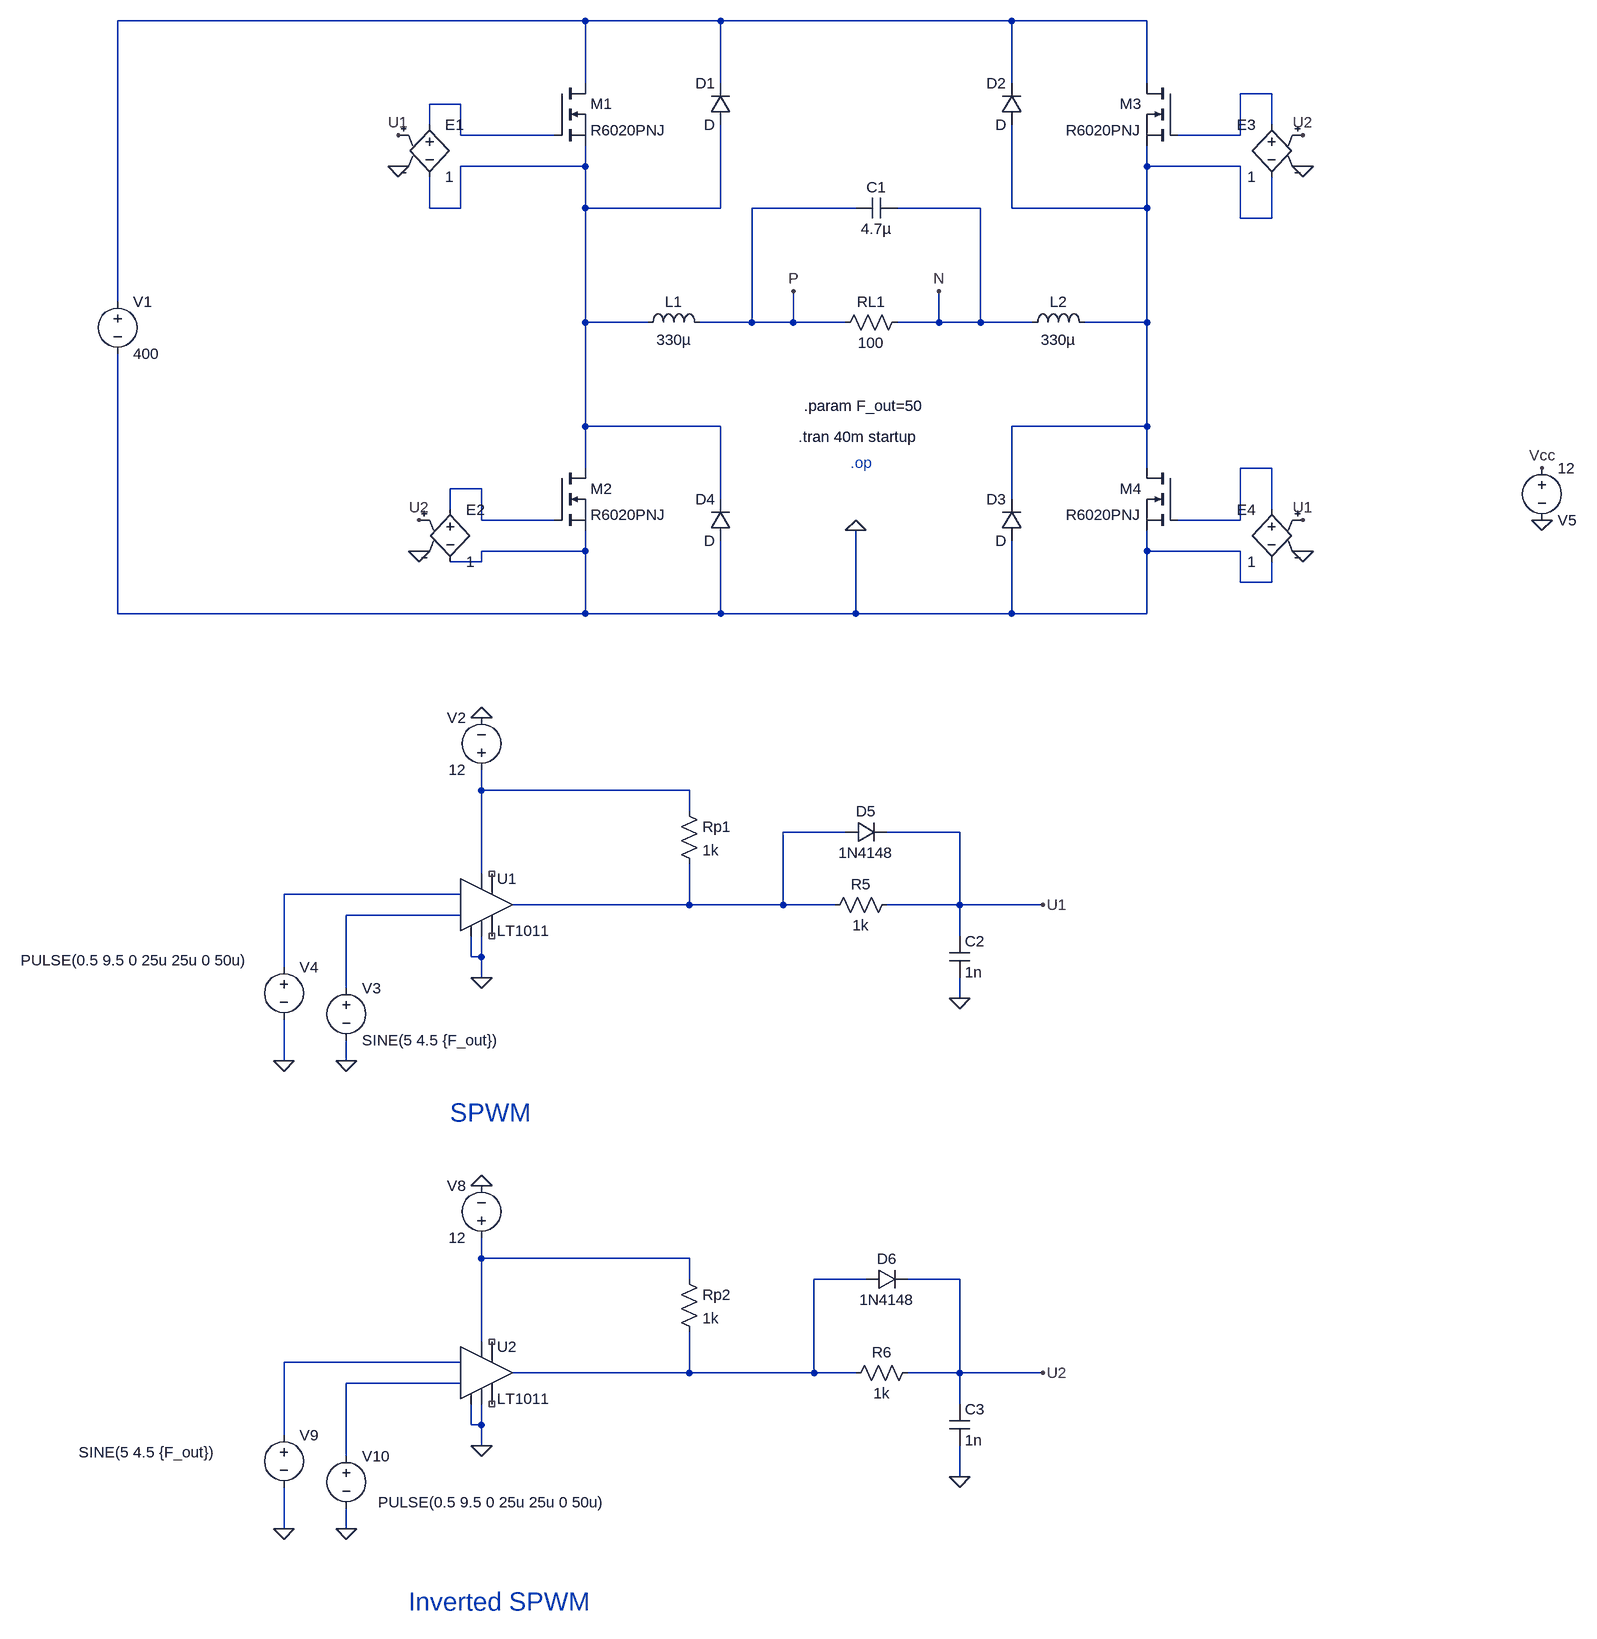
[diagram p0: schematic VCVS_Swtiches.asc]
VCVS_Swtiches.asc, the LTspice schematic file:
Version 4.1
SHEET 1 1320 1532
WIRE -208 -928 -928 -928
WIRE 0 -928 -208 -928
WIRE 448 -928 0 -928
WIRE 656 -928 448 -928
WIRE -208 -832 -208 -928
WIRE 0 -832 0 -928
WIRE 448 -832 448 -928
WIRE 656 -832 656 -928
WIRE 848 -816 800 -816
WIRE -400 -800 -448 -800
WIRE -448 -768 -448 -800
WIRE 848 -768 848 -816
WIRE -400 -752 -400 -800
WIRE -256 -752 -400 -752
WIRE 800 -752 800 -816
WIRE 800 -752 704 -752
WIRE -208 -704 -208 -736
WIRE -208 -704 -400 -704
WIRE 656 -704 656 -736
WIRE 800 -704 656 -704
WIRE -448 -640 -448 -688
WIRE -400 -640 -400 -704
WIRE -400 -640 -448 -640
WIRE -208 -640 -208 -704
WIRE 0 -640 0 -768
WIRE 0 -640 -208 -640
WIRE 208 -640 48 -640
WIRE 400 -640 272 -640
WIRE 448 -640 448 -768
WIRE 656 -640 656 -704
WIRE 656 -640 448 -640
WIRE 800 -624 800 -704
WIRE 848 -624 848 -688
WIRE 848 -624 800 -624
WIRE -928 -496 -928 -928
WIRE -208 -464 -208 -640
WIRE -112 -464 -208 -464
WIRE 48 -464 48 -640
WIRE 48 -464 -32 -464
WIRE 112 -464 112 -512
WIRE 112 -464 48 -464
WIRE 192 -464 112 -464
WIRE 336 -464 336 -512
WIRE 336 -464 272 -464
WIRE 400 -464 400 -640
WIRE 400 -464 336 -464
WIRE 480 -464 400 -464
WIRE 656 -464 656 -640
WIRE 656 -464 560 -464
WIRE -208 -304 -208 -464
WIRE 0 -304 -208 -304
WIRE 656 -304 656 -464
WIRE 656 -304 448 -304
WIRE -208 -240 -208 -304
WIRE 656 -240 656 -304
WIRE 848 -240 800 -240
WIRE -368 -208 -416 -208
WIRE 0 -192 0 -304
WIRE 448 -192 448 -304
WIRE -416 -176 -416 -208
WIRE 848 -176 848 -240
WIRE -368 -160 -368 -208
WIRE -256 -160 -368 -160
WIRE 800 -160 800 -240
WIRE 800 -160 704 -160
WIRE -208 -112 -208 -144
WIRE -208 -112 -368 -112
WIRE 656 -112 656 -144
WIRE 800 -112 656 -112
WIRE -368 -96 -368 -112
WIRE -368 -96 -416 -96
WIRE 800 -64 800 -112
WIRE 848 -64 848 -96
WIRE 848 -64 800 -64
WIRE -928 -16 -928 -416
WIRE -208 -16 -208 -112
WIRE -208 -16 -928 -16
WIRE 0 -16 0 -128
WIRE 0 -16 -208 -16
WIRE 208 -16 208 -144
WIRE 208 -16 0 -16
WIRE 448 -16 448 -128
WIRE 448 -16 208 -16
WIRE 656 -16 656 -112
WIRE 656 -16 448 -16
WIRE -368 256 -368 224
WIRE -48 256 -368 256
WIRE -48 288 -48 256
WIRE 192 320 96 320
WIRE 368 320 256 320
WIRE -368 384 -368 256
WIRE -400 416 -672 416
WIRE -48 432 -48 368
WIRE -48 432 -320 432
WIRE 96 432 96 320
WIRE 96 432 -48 432
WIRE 176 432 96 432
WIRE 368 432 368 320
WIRE 368 432 256 432
WIRE 496 432 368 432
WIRE -400 448 -576 448
WIRE 368 480 368 432
WIRE -384 512 -384 480
WIRE -368 512 -368 480
WIRE -368 512 -384 512
WIRE -672 528 -672 416
WIRE -368 544 -368 512
WIRE -576 560 -576 448
WIRE 368 576 368 544
WIRE -672 672 -672 608
WIRE -576 672 -576 640
WIRE -368 976 -368 944
WIRE -48 976 -368 976
WIRE -48 1008 -48 976
WIRE 224 1008 144 1008
WIRE 368 1008 288 1008
WIRE -368 1104 -368 976
WIRE -400 1136 -672 1136
WIRE -48 1152 -48 1088
WIRE -48 1152 -320 1152
WIRE 144 1152 144 1008
WIRE 144 1152 -48 1152
WIRE 208 1152 144 1152
WIRE 368 1152 368 1008
WIRE 368 1152 288 1152
WIRE 496 1152 368 1152
WIRE -400 1168 -576 1168
WIRE 368 1200 368 1152
WIRE -384 1232 -384 1200
WIRE -368 1232 -368 1200
WIRE -368 1232 -384 1232
WIRE -672 1248 -672 1136
WIRE -368 1264 -368 1232
WIRE -576 1280 -576 1168
WIRE 368 1312 368 1264
WIRE -672 1392 -672 1328
WIRE -576 1392 -576 1360
FLAG 208 -144 0
FLAG -368 544 0
FLAG -368 144 0
FLAG -576 672 0
FLAG -672 672 0
FLAG 1264 -160 0
FLAG 1264 -240 Vcc
FLAG -368 1264 0
FLAG -368 864 0
FLAG -576 1392 0
FLAG -672 1392 0
FLAG 496 432 U1
FLAG 496 1152 U2
FLAG 112 -512 P
FLAG 336 -512 N
FLAG 368 576 0
FLAG 368 1312 0
FLAG 896 -160 U1
FLAG -496 -752 U1
FLAG -464 -160 U2
FLAG 896 -752 U2
FLAG 896 -704 0
FLAG 896 -112 0
FLAG -464 -112 0
FLAG -496 -704 0
SYMBOL Comparators\\LT1011 -368 432 R0
SYMATTR InstName U1
SYMBOL voltage -928 -512 R0
WINDOW 123 0 0 Left 0
WINDOW 39 0 0 Left 0
SYMATTR InstName V1
SYMATTR Value 400
SYMBOL diode 16 -768 R180
WINDOW 0 24 64 Left 2
WINDOW 3 24 0 Left 2
SYMATTR InstName D1
SYMBOL diode 464 -768 R180
WINDOW 0 24 64 Left 2
WINDOW 3 24 0 Left 2
SYMATTR InstName D2
SYMBOL diode 464 -128 R180
WINDOW 0 24 64 Left 2
WINDOW 3 24 0 Left 2
SYMATTR InstName D3
SYMBOL diode 16 -128 R180
WINDOW 0 24 64 Left 2
WINDOW 3 24 0 Left 2
SYMATTR InstName D4
SYMBOL res 288 -480 R90
WINDOW 0 0 56 VBottom 2
WINDOW 3 32 56 VTop 2
SYMATTR InstName RL1
SYMATTR Value 100
SYMBOL ind -128 -448 R270
WINDOW 0 32 56 VTop 2
WINDOW 3 5 56 VBottom 2
SYMATTR InstName L1
SYMATTR Value 330µ
SYMATTR SpiceLine Rser=0.1
SYMBOL ind 464 -448 R270
WINDOW 0 32 56 VTop 2
WINDOW 3 5 56 VBottom 2
SYMATTR InstName L2
SYMATTR Value 330µ
SYMATTR SpiceLine Rser=0.1
SYMBOL cap 272 -656 R90
WINDOW 0 0 32 VBottom 2
WINDOW 3 32 32 VTop 2
SYMATTR InstName C1
SYMATTR Value 4.7µ
SYMATTR SpiceLine Rser=0.1
SYMBOL nmos -256 -832 R0
SYMATTR InstName M1
SYMATTR Value R6020PNJ
SYMBOL nmos -256 -240 R0
SYMATTR InstName M2
SYMATTR Value R6020PNJ
SYMBOL nmos 704 -832 M0
SYMATTR InstName M3
SYMATTR Value R6020PNJ
SYMBOL nmos 704 -240 M0
SYMATTR InstName M4
SYMATTR Value R6020PNJ
SYMBOL voltage -368 240 R180
WINDOW 0 24 96 Left 2
WINDOW 3 24 16 Left 2
WINDOW 123 0 0 Left 0
WINDOW 39 0 0 Left 0
SYMATTR InstName V2
SYMATTR Value 12
SYMBOL voltage -576 544 R0
WINDOW 123 0 0 Left 0
WINDOW 39 0 0 Left 0
SYMATTR InstName V3
SYMATTR Value SINE(5 4.5 {F_out})
SYMBOL voltage -672 512 R0
WINDOW 3 -405 5 Left 2
WINDOW 123 0 0 Left 0
WINDOW 39 0 0 Left 0
SYMATTR Value PULSE(0.5 9.5 0 25u 25u 0 50u)
SYMATTR InstName V4
SYMBOL res -64 272 R0
SYMATTR InstName Rp1
SYMATTR Value 1k
SYMBOL voltage 1264 -256 R0
WINDOW 0 24 96 Left 2
WINDOW 3 24 16 Left 2
WINDOW 123 0 0 Left 0
WINDOW 39 0 0 Left 0
SYMATTR InstName V5
SYMATTR Value 12
SYMBOL Comparators\\LT1011 -368 1152 R0
SYMATTR InstName U2
SYMBOL voltage -368 960 R180
WINDOW 0 24 96 Left 2
WINDOW 3 24 16 Left 2
WINDOW 123 0 0 Left 0
WINDOW 39 0 0 Left 0
SYMATTR InstName V8
SYMATTR Value 12
SYMBOL voltage -672 1232 R0
WINDOW 123 0 0 Left 0
WINDOW 39 0 0 Left 0
WINDOW 3 -316 42 Left 2
SYMATTR Value SINE(5 4.5 {F_out})
SYMATTR InstName V9
SYMBOL voltage -576 1264 R0
WINDOW 3 49 87 Left 2
WINDOW 123 0 0 Left 0
WINDOW 39 0 0 Left 0
SYMATTR Value PULSE(0.5 9.5 0 25u 25u 0 50u)
SYMATTR InstName V10
SYMBOL res -64 992 R0
SYMATTR InstName Rp2
SYMATTR Value 1k
SYMBOL res 272 416 R90
WINDOW 0 0 56 VBottom 2
WINDOW 3 32 56 VTop 2
SYMATTR InstName R5
SYMATTR Value 1k
SYMBOL diode 192 336 R270
WINDOW 0 32 32 VTop 2
WINDOW 3 0 32 VBottom 2
SYMATTR InstName D5
SYMATTR Value 1N4148
SYMBOL cap 352 480 R0
SYMATTR InstName C2
SYMATTR Value 1n
SYMBOL res 192 1168 R270
WINDOW 0 32 56 VTop 2
WINDOW 3 0 56 VBottom 2
SYMATTR InstName R6
SYMATTR Value 1k
SYMBOL diode 224 1024 R270
WINDOW 0 32 32 VTop 2
WINDOW 3 0 32 VBottom 2
SYMATTR InstName D6
SYMATTR Value 1N4148
SYMBOL cap 352 1200 R0
SYMATTR InstName C3
SYMATTR Value 1n
SYMBOL e -448 -784 R0
SYMATTR InstName E1
SYMATTR Value 1
SYMBOL e -416 -192 R0
SYMATTR InstName E2
SYMATTR Value 1
SYMBOL e 848 -192 M0
SYMATTR InstName E4
SYMATTR Value 1
SYMBOL e 848 -784 M0
SYMATTR InstName E3
SYMATTR Value 1
TEXT 120 -288 Left 2 !.tran 40m startup
TEXT 128 -336 Left 2 !.param F_out=50
TEXT -416 752 Left 4 ;SPWM
TEXT -480 1504 Left 4 ;Inverted SPWM
TEXT 200 -248 Left 2 ;.op

The netlist it stands for:
* VCVS_Swtiches.asc
X§U1 0 N011 N010 0 NC_01 NC_02 N009 N008 LT1011
V1 N001 0 400
D1 N004 N001 D
D2 N005 N001 D
D3 0 N005 D
D4 0 N004 D
RL1 N P 100
L1 N004 P 330µ Rser=0.1
L2 N N005 330µ Rser=0.1
C1 N P 4.7µ Rser=0.1
M1 N001 N003 N004 N004 R6020PNJ
M2 N004 N007 0 0 R6020PNJ
M3 N001 N002 N005 N005 R6020PNJ
M4 N005 N006 0 0 R6020PNJ
V2 N008 0 12
V3 N011 0 SINE(5 4.5 {F_out})
V4 N010 0 PULSE(0.5 9.5 0 25u 25u 0 50u)
Rp1 N008 N009 1k
V5 Vcc 0 12
X§U2 0 N015 N014 0 NC_03 NC_04 N013 N012 LT1011
V8 N012 0 12
V9 N014 0 SINE(5 4.5 {F_out})
V10 N015 0 PULSE(0.5 9.5 0 25u 25u 0 50u)
Rp2 N012 N013 1k
R5 U1 N009 1k
D5 N009 U1 1N4148
C2 U1 0 1n
R6 N013 U2 1k
D6 N013 U2 1N4148
C3 U2 0 1n
E1 N003 N004 U1 0 1
E2 N007 0 U2 0 1
E4 N006 0 U1 0 1
E3 N002 N005 U2 0 1
.model D D
.lib standard.dio
.model NMOS NMOS
.model PMOS PMOS
.lib standard.mos
.tran 40m startup
.param F_out=50
* SPWM
* Inverted SPWM
* .op
.lib LTC1.lib
.backanno
.end